# Altium schematic sheet ParralelLEDStrip.SchDoc
size A
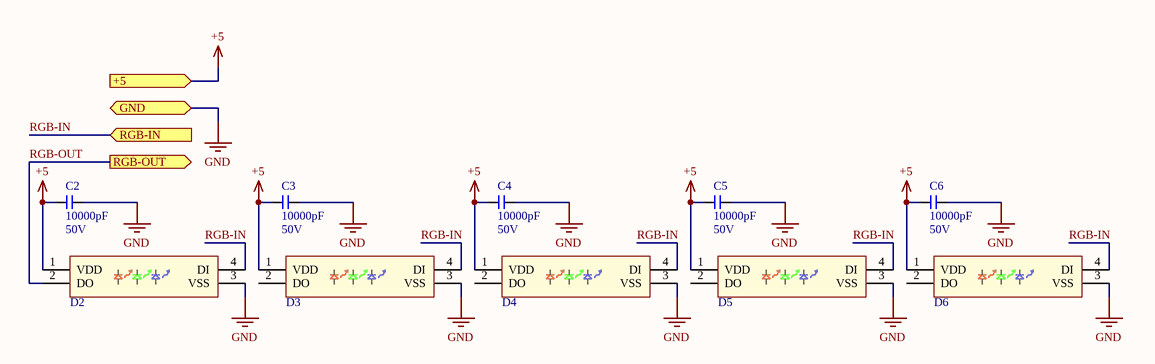
[diagram p0: ParralelLEDStrip.SchDoc]

## Parts
C2  Capacitance (shorthand): 10000pF  Rated Voltage: 50V  [C0805]  (hidden comment: __template_cap)
C3  Capacitance (shorthand): 10000pF  Rated Voltage: 50V  [C0805]  (hidden comment: __template_cap)
C4  Capacitance (shorthand): 10000pF  Rated Voltage: 50V  [C0805]  (hidden comment: __template_cap)
C5  Capacitance (shorthand): 10000pF  Rated Voltage: 50V  [C0805]  (hidden comment: __template_cap)
C6  Capacitance (shorthand): 10000pF  Rated Voltage: 50V  [C0805]  (hidden comment: __template_cap)
D2  LED_WS2812B  [4DFN5X5_WGS2812B]  (value not drawn)
D3  LED_WS2812B  [4DFN5X5_WGS2812B]  (value not drawn)
D4  LED_WS2812B  [4DFN5X5_WGS2812B]  (value not drawn)
D5  LED_WS2812B  [4DFN5X5_WGS2812B]  (value not drawn)
D6  LED_WS2812B  [4DFN5X5_WGS2812B]  (value not drawn)

## Ports
+5 (in), GND (bidir), RGB-IN (in), RGB-OUT (out)

## Nets
+5: C2.1 C3.1 C4.1 C5.1 C6.1 D2.1(VDD) D3.1(VDD) D4.1(VDD) D5.1(VDD) D6.1(VDD) ; port +5
GND: C2.2 C3.2 C4.2 C5.2 C6.2 D2.3(VSS) D3.3(VSS) D4.3(VSS) D5.3(VSS) D6.3(VSS) ; port GND
RGB-IN: D2.4(DI) D3.4(DI) D4.4(DI) D5.4(DI) D6.4(DI) ; port RGB-IN
RGB-OUT: D2.2(DO) ; port RGB-OUT

Not connected (* = marked no-connect by the designer): D3 2(DO); D4 2(DO); D5 2(DO); D6 2(DO)

## Library data of the parts
C2-C6 = CAP CER 10000PF 50V X7R 0805: Manufacturer: Murata Electronics North America; Capacitance - pF (Machine readable): 10000; type: capacitor; Dielectric: X7R; Supplier Part Number 1: 490-1664-1-ND
D2-D6 = LED_WS2812B: LED RGB WS2812B